# Altium schematic sheet Sheet1.SchDoc
size A4
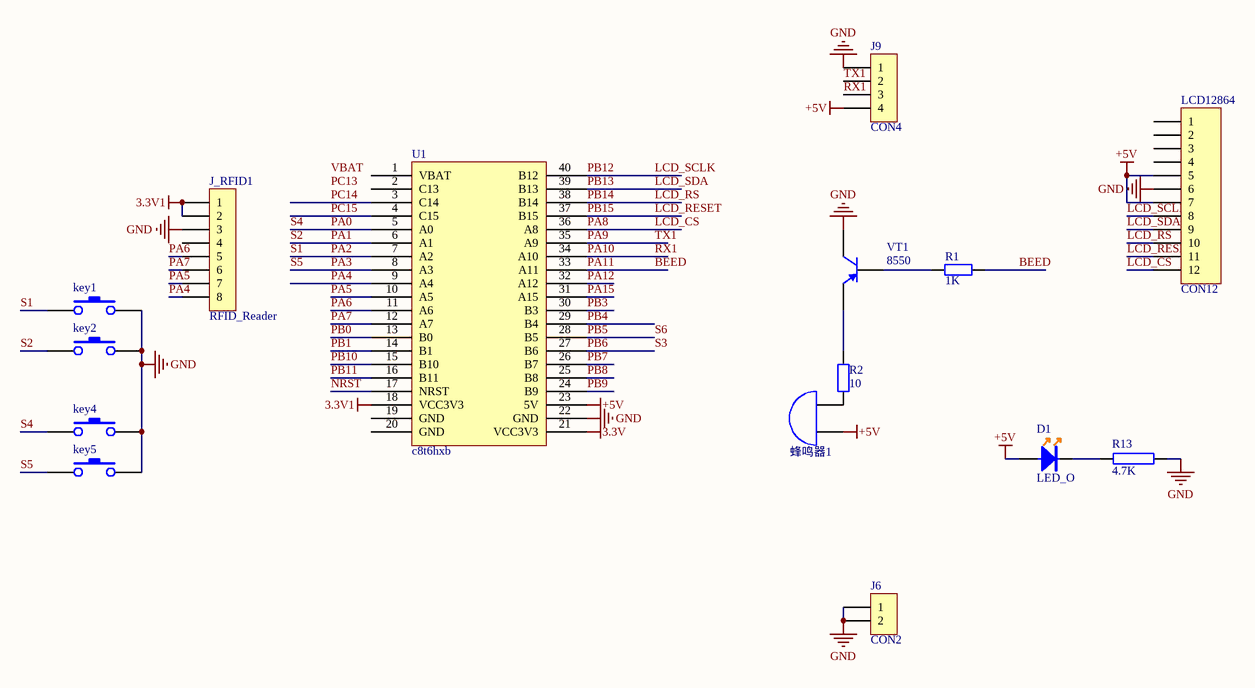
[diagram p0: Sheet1.SchDoc]

## Parts
D1  LED_O  [D0805]
J6  CON2  [sip-2]
J9  CON4  [sip-4]
J_RFID1  RFID_Reader  [SIP-8]
key1  (no value)  [SW_SMD_P2]
key2  (no value)  [SW_SMD_P2]
key4  (no value)  [SW_SMD_P2]
key5  (no value)  [SW_SMD_P2]
LCD12864  CON12  [sip-12]
R1  value 1K  [0805]  (hidden comment: Res)
R2  value 10  [0805]  (hidden comment: Res)
R13  4.7K  [0805]
U1  c8t6hxb  [48P]
VT1  8550  [SOT-23]
蜂鸣器1  蜂鸣器  [DB]  (value not drawn)

## Nets
3.3V: U1.21(VCC3V3)
3.3V1: J_RFID1.1 J_RFID1.2 U1.18(VCC3V3)
+5V: D1.1 J9.4 LCD12864.5 LCD12864.7 U1.23(5V) 蜂鸣器1.1(A)
GND: J6.1 J6.2 J9.1 J_RFID1.3 key1.2 key2.2 key4.2 key5.2 LCD12864.6 R13.2 U1.22(GND) VT1.1(C)
BEED: R1.2 U1.33(A11)  [also labelled PA11]
LCD_CS: LCD12864.12 U1.36(A8)  [also labelled PA8]
LCD_RESET: LCD12864.11 U1.37(B15)  [also labelled PB15]
LCD_RS: LCD12864.10 U1.38(B14)  [also labelled PB14]
LCD_SCLK: LCD12864.8 U1.40(B12)  [also labelled PB12]
LCD_SDA: LCD12864.9 U1.39(B13)  [also labelled PB13]
NRST: U1.17(NRST)
PA0: key4.1 U1.5(A0)  [also labelled S4]
PA1: key2.1 U1.6(A1)  [also labelled S2]
PA2: key1.1 U1.7(A2)  [also labelled S1]
PA3: key5.1 U1.8(A3)  [also labelled S5]
PA4: J_RFID1.8 U1.9(A4)
PA5: J_RFID1.7 U1.10(A5)
PA6: J_RFID1.5 U1.11(A6)
PA7: J_RFID1.6 U1.12(A7)
PA9: J9.2 U1.35(A9)  [also labelled TX1]
PA10: J9.3 U1.34(A10)  [also labelled RX1]
PA12: U1.32(A12)
PA15: U1.31(A15)
PB0: U1.13(B0)
PB1: U1.14(B1)
PB3: U1.30(B3)
PB4: U1.29(B4)
PB5: U1.28(B5)  [also labelled S6]
PB6: U1.27(B6)  [also labelled S3]
PB7: U1.26(B7)
PB8: U1.25(B8)
PB9: U1.24(B9)
PB10: U1.15(B10)
PB11: U1.16(B11)
PC14: U1.3(C14)
PC15: U1.4(C15)
NetD1_2: D1.2 R13.1
NetR1_1: R1.1 VT1.2(B)
NetR2_1: R2.1 蜂鸣器1.2(B)
NetR2_2: R2.2 VT1.3(E)

Not connected (* = marked no-connect by the designer): J_RFID1 4; LCD12864 1 2 3 4; U1 1(VBAT) 2(C13) 19(GND) 20(GND)

## Notes on the sheet
- Labels drawn without touching a wire or pin: PC13, VBAT

## Library data of the parts
J6 = CON2: Connector
J9 = CON4: Connector
J_RFID1 = CON8: Connector
key1 key2 key4 key5 = SW-PB
LCD12864 = CON12: Connector
R13 = RES
VT1 = 8550: pin to pad: 1>3 3>1